# Altium schematic sheet Glucometer-E.C.- Full V1.2.SchDoc
size Letter; PageSetup: Record=PageOptions|CenterHorizontal=True|CenterVertical=True|PrintScale=0.95|XCorrection=1.00|YCorrection=1.00|PrintKind=2|BorderSize=5000000|LeftOffset=0|BottomOffset=0|Orientation=2|PaperLength=1000|PaperWidth=1000|Scale=100|PaperSource=7|PrintQuality=-4|MediaType=1|DitherType=10|PaperKind=Carta|PrintScaleMode=1
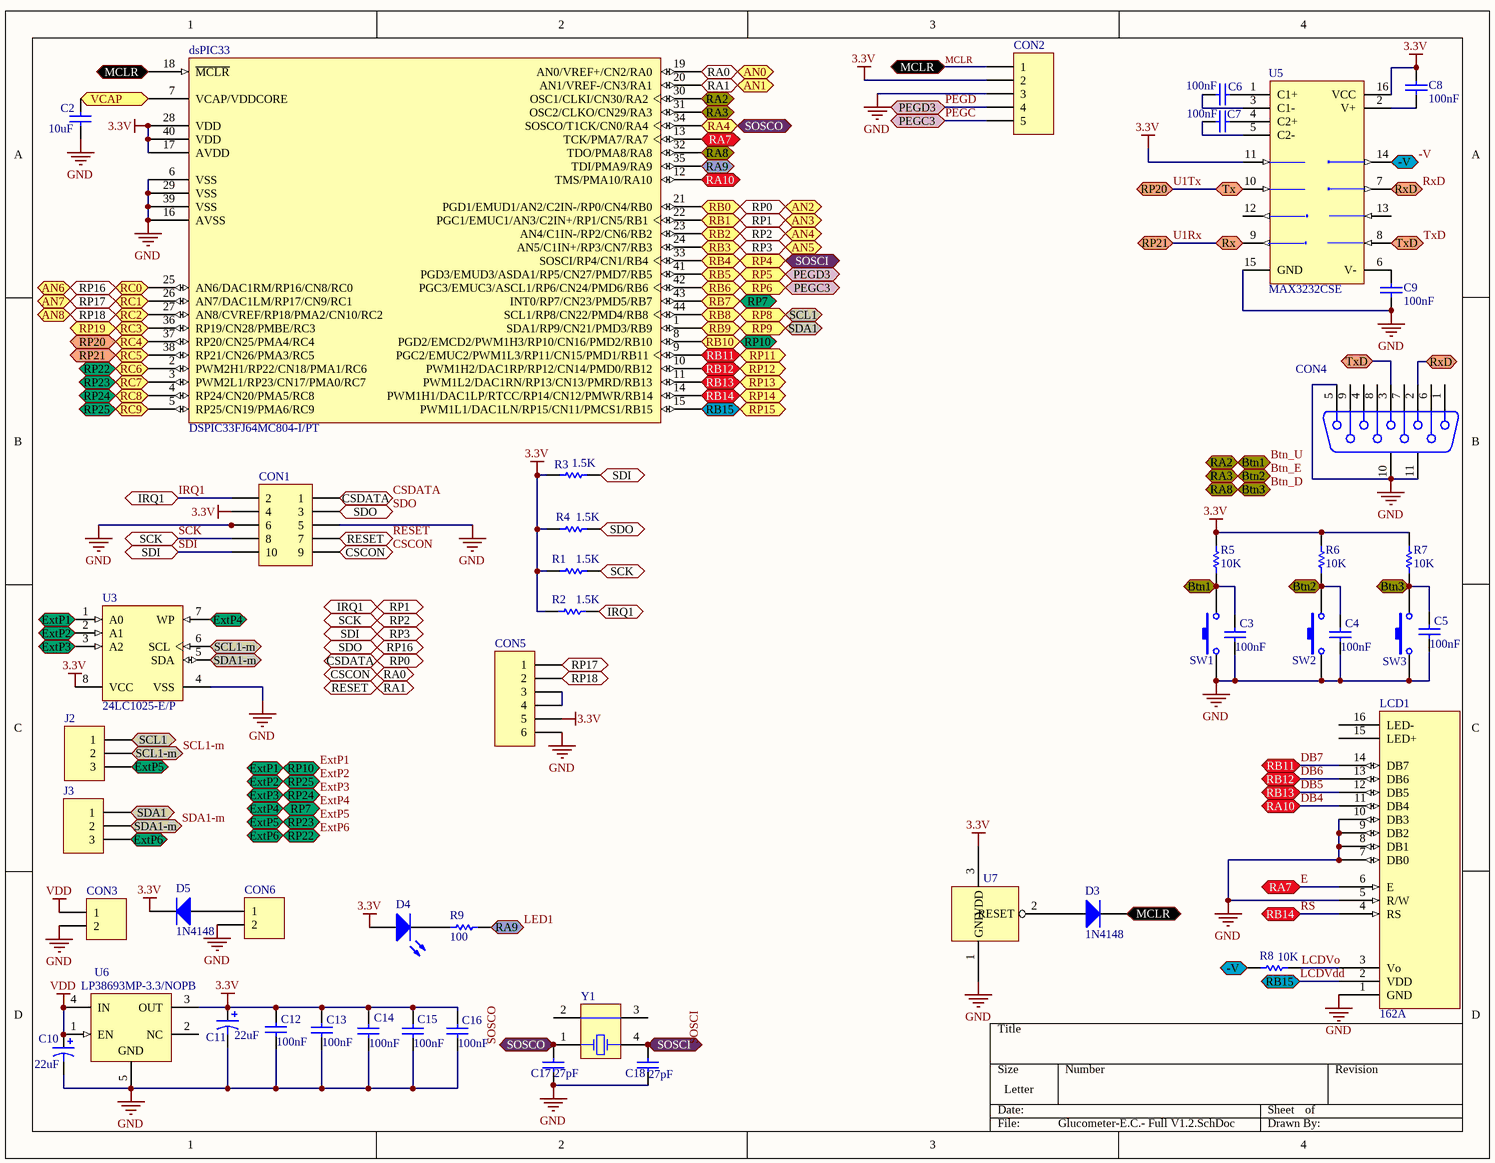
[diagram p0: Glucometer-E.C.- Full V1.2.SchDoc]

## Parts
C2  value 10uF  [CAPC2012N]  (hidden comment: Cap)
C3  value 100nF  [CAPC1608N]  (hidden comment: Cap)
C4  value 100nF  [CAPC1608N]  (hidden comment: Cap)
C5  value 100nF  [CAPC1608N]  (hidden comment: Cap)
C6  value 100nF  [RESC1608N]  (hidden comment: Cap)
C7  value 100nF  [RESC1608N]  (hidden comment: Cap)
C8  value 100nF  [RESC1608N]  (hidden comment: Cap)
C9  value 100nF  [RESC1608N]  (hidden comment: Cap)
C10  value 22uF  [C-4x4]  (hidden comment: Cap Pol2)
C11  value 22uF  [C-4x4]  (hidden comment: Cap Pol2)
C12  value 100nF  [CAPC1608N]  (hidden comment: Cap)
C13  value 100nF  [CAPC1608N]  (hidden comment: Cap)
C14  value 100nF  [CAPC1608N]  (hidden comment: Cap)
C15  value 100nF  [CAPC1608N]  (hidden comment: Cap)
C16  value 100nF  [CAPC1608N]  (hidden comment: Cap)
C17  value 27pF  [CAPC1608N]  (hidden comment: Cap)
C18  value 27pF  [CAPC1608N]  (hidden comment: Cap)
CON1  Header 5X2  [HDR2X5]  (value not drawn)
CON2  Header 5  [HDR1X5]  (value not drawn)
CON3  Header 2  [HDR1X2]  (value not drawn)
CON4  D Connector 9  [DSUB1.385-2H9]  (value not drawn)
CON5  Header 6  [HDR1X6]  (value not drawn)
CON6  Header 2  [HDR1X2]  (value not drawn)
D3  1N4148  [CD3216-1206]
D4  LED2  [3.2X1.6X1.1]  (value not drawn)
D5  1N4148  [DO-35]
dsPIC33  DSPIC33FJ64MC804-I/PT  [TQFP-PT44_N]
J2  Header 3  [HDR1X3]  (value not drawn)
J3  Header 3  [HDR1X3]  (value not drawn)
LCD1  162A  [HDR1X14]
R1  value 1.5K  [RESC2012N]  (hidden comment: Res1)
R2  value 1.5K  [RESC2012N]  (hidden comment: Res1)
R3  value 1.5K  [RESC2012N]  (hidden comment: Res1)
R4  value 1.5K  [RESC2012N]  (hidden comment: Res1)
R5  value 10K  [RESC2012N]  (hidden comment: Res1)
R6  value 10K  [RESC2012N]  (hidden comment: Res1)
R7  value 10K  [RESC2012N]  (hidden comment: Res1)
R8  value 10K  [RESC2012N]  (hidden comment: Res1)
R9  value 100  [RESC2012N]  (hidden comment: Res1)
SW1  SW-PB  [DPST-4]  (value not drawn)
SW2  SW-PB  [DPST-4]  (value not drawn)
SW3  SW-PB  [DPST-4]  (value not drawn)
U3  24LC1025-E/P  [PDIP300-P8]
U5  MAX3232CSE  [NSO16_N]
U6  LP38693MP-3.3/NOPB  [MP05A_N]
U7  Supply Voltage Supervisor  [SOT23]  (value not drawn)
Y1  ECS-240-20-7S  [ECX-3S]  (value not drawn)

## Ports
-V, AN0, AN1, AN2, AN3, AN4, AN5, AN6, AN7, AN8, Btn1, Btn2, Btn3, CSCON, CSDATA, ExtP1, ExtP2, ExtP3, ExtP4, ExtP5, ExtP6, IRQ1, MCLR, PEGC3, PEGD3, RA0, RA1, RA2, RA3, RA4, RA7, RA8, RA9, RA10, RB0, RB1, RB2, RB3, RB4, RB5, RB6, RB7, RB8, RB9, RB10, RB11, RB12, RB13, RB14, RB15, RC0, RC1, RC2, RC3, RC4, RC5, RC6, RC7, RC8, RC9, RESET, RP0, RP1, RP2, RP3, RP4, RP5, RP6, RP7, RP8, RP9, RP10, RP11, RP12, RP13, RP14, RP15, RP16, RP17, RP18, RP19, RP20, RP21, RP22, RP23, RP24, RP25, Rx, RxD, SCK, SCL1, SCL1-m, SDA1, SDA1-m, SDI, SDO, SOSCI, SOSCO, Tx, TxD, VCAP

## Nets
3.3V: C8.1 C11.1 C12.2 C13.2 C14.2 C15.2 C16.2 CON1.4 CON2.2 CON5.5 D4.1(A) D5.2(K) dsPIC33.17(AVDD) dsPIC33.28(VDD) dsPIC33.40(VDD) R1.1 R2.1 R3.1 R4.1 R5.2 R6.2 R7.2 U3.8(VCC) U5.11(T1IN) U5.16(VCC) U6.3(OUT) U7.3(VDD)
GND: C2.1 C3.1 C4.1 C5.1 C9.2 C10.2 C11.2 C12.1 C13.1 C14.1 C15.1 C16.1 C17.1 C18.1 CON1.5 CON1.6 CON2.3 CON3.2 CON4.5 CON4.10(MH1) CON4.11(MH2) CON5.6 CON6.2 dsPIC33.6(VSS) dsPIC33.16(AVSS) dsPIC33.29(VSS) dsPIC33.39(VSS) LCD1.1(GND) LCD1.5(R/W) LCD1.7(DB0) LCD1.8(DB1) LCD1.9(DB2) LCD1.10(DB3) SW1.1 SW2.1 SW3.1 U3.4(VSS) U5.15(GND) U6.5(GND) U7.1(GND)
VDD: C10.1 CON3.1 U6.1(EN) U6.4(IN)
-V: R8.2 U5.14(T1OUT) ; port -V
AN7: CON5.1 dsPIC33.26(AN7/DAC1LM/RP17/CN9/RC1) ; port AN7, port RC1, port RP17
AN8: CON5.2 dsPIC33.27(AN8/CVREF/RP18/PMA2/CN10/RC2) ; port AN8, port RC2, port RP18
Btn_D: C5.2 dsPIC33.32(TDO/PMA8/RA8) R7.1 SW3.2 ; port RA8, port Btn3
Btn_E: C4.2 dsPIC33.31(OSC2/CLKO/CN29/RA3) R6.1 SW2.2 ; port RA3, port Btn2
Btn_U: C3.2 dsPIC33.30(OSC1/CLKI/CN30/RA2) R5.1 SW1.2 ; port Btn1, port RA2
CSCON: CON1.9 dsPIC33.19(AN0/VREF+/CN2/RA0) ; port RA0, port AN0, port CSCON
CSDATA: CON1.1 dsPIC33.21(PGD1/EMUD1/AN2/C2IN-/RP0/CN4/RB0) ; port RB0, port RP0, port AN2, port CSDATA
DB4: dsPIC33.12(TMS/PMA10/RA10) LCD1.11(DB4) ; port RA10
DB5: dsPIC33.11(PWM1L2/DAC1RN/RP13/CN13/PMRD/RB13) LCD1.12(DB5) ; port RP13, port RB13
DB6: dsPIC33.10(PWM1H2/DAC1RP/RP12/CN14/PMD0/RB12) LCD1.13(DB6) ; port RP12, port RB12
DB7: dsPIC33.9(PGC2/EMUC2/PWM1L3/RP11/CN15/PMD1/RB11) LCD1.14(DB7) ; port RP11, port RB11
E: dsPIC33.13(TCK/PMA7/RA7) LCD1.6(E) ; port RA7
ExtP1: dsPIC33.8(PGD2/EMCD2/PWM1H3/RP10/CN16/PMD2/RB10) U3.1(A0) ; port RB10, port ExtP1, port RP10
ExtP2: dsPIC33.5(RP25/CN19/PMA6/RC9) U3.2(A1) ; port ExtP2, port RC9, port RP25
ExtP3: dsPIC33.4(RP24/CN20/PMA5/RC8) U3.3(A2) ; port ExtP3, port RC8, port RP24
ExtP4: dsPIC33.43(INT0/RP7/CN23/PMD5/RB7) U3.7(WP) ; port RB7, port ExtP4, port RP7
ExtP5: dsPIC33.3(PWM2L1/RP23/CN17/PMA0/RC7) J2.3 ; port ExtP5, port RC7, port RP23
ExtP6: dsPIC33.2(PWM2H1/RP22/CN18/PMA1/RC6) J3.3 ; port ExtP6, port RC6, port RP22
IRQ1: CON1.2 dsPIC33.22(PGC1/EMUC1/AN3/C2IN+/RP1/CN5/RB1) R2.2 ; port RB1, port RP1, port AN3, port IRQ1
LCDVdd: dsPIC33.15(PWM1L1/DAC1LN/RP15/CN11/PMCS1/RB15) LCD1.2(VDD) ; port RP15, port RB15
LCDVo: LCD1.3(Vo) R8.1
LED1: dsPIC33.35(TDI/PMA9/RA9) R9.1 ; port RA9
MCLR: CON2.1 D3.2(K) dsPIC33.18(~{MCLR}) ; port MCLR
PEGC: CON2.5 dsPIC33.42(PGC3/EMUC3/ASCL1/RP6/CN24/PMD6/RB6) ; port RB6, port RP6, port PEGC3
PEGD: CON2.4 dsPIC33.41(PGD3/EMUD3/ASDA1/RP5/CN27/PMD7/RB5) ; port RB5, port RP5, port PEGD3
RB8: dsPIC33.44(SCL1/RP8/CN22/PMD4/RB8) J2.1 ; port RP8, port SCL1, port RB8
RB9: dsPIC33.1(SDA1/RP9/CN21/PMD3/RB9) J3.1 ; port RP9, port SDA1, port RB9
RC3: dsPIC33.36(RP19/CN28/PMBE/RC3) ; port RC3, port RP19
RESET: CON1.7 dsPIC33.20(AN1/VREF-/CN3/RA1) ; port RA1, port AN1, port RESET
RS: dsPIC33.14(PWM1H1/DAC1LP/RTCC/RP14/CN12/PMWR/RB14) LCD1.4(RS) ; port RP14, port RB14
RxD: CON4.2 U5.7(T2OUT) ; port RxD
SCK: CON1.8 dsPIC33.23(AN4/C1IN-/RP2/CN6/RB2) R1.2 ; port RB2, port RP2, port AN4, port SCK
SCL1-m: J2.2 U3.6(SCL) ; port SCL1-m
SDA1-m: J3.2 U3.5(SDA) ; port SDA1-m
SDI: CON1.10 dsPIC33.24(AN5/C1IN+/RP3/CN7/RB3) R3.2 ; port RB3, port SDI, port RP3, port AN5
SDO: CON1.3 dsPIC33.25(AN6/DAC1RM/RP16/CN8/RC0) R4.2 ; port RP16, port AN6, port SDO, port RC0
SOSCI: C18.2 dsPIC33.33(SOSCI/RP4/CN1/RB4) Y1.4(OSC2) ; port RP4, port RB4, port SOSCI
SOSCO: C17.2 dsPIC33.34(SOSCO/T1CK/CN0/RA4) Y1.1(OSC1) ; port RA4, port SOSCO
TxD: CON4.3 U5.8(R2IN) ; port TxD
U1Rx: dsPIC33.38(RP21/CN26/PMA3/RC5) U5.9(R2OUT) ; port RP21, port Rx, port RC5
U1Tx: dsPIC33.37(RP20/CN25/PMA4/RC4) U5.10(T2IN) ; port RP20, port Tx, port RC4
VCAP: C2.2 dsPIC33.7(VCAP/VDDCORE) ; port VCAP
NetC6_1: C6.1 U5.1(C1+)
NetC6_2: C6.2 U5.3(C1-)
NetC7_1: C7.1 U5.4(C2+)
NetC7_2: C7.2 U5.5(C2-)
NetC8_2: C8.2 U5.2(V+)
NetC9_1: C9.1 U5.6(V-)
NetCON5_3: CON5.3 CON5.4
NetCON6_1: CON6.1 D5.1(A)
NetD3_1: D3.1(A) U7.2(RESET)
NetD4_2: D4.2(K) R9.2

Not connected (* = marked no-connect by the designer): CON4 1 4 6 7 8 9; LCD1 15(LED+) 16(LED-); U5 12(R1OUT) 13(R1IN); U6 2(NC); Y1 2(COM) 3(COM)

## Library data of the parts
C2-C9 C12-C18 = Cap: Capacitor; Published: 8-Jun-2000; LatestRevisionDate: 17-Jul-2002; LatestRevisionNote: Re-released for DXP Platform.; PackageReference: RAD-0.3; Publisher: Altium Limited; PackageDescription: Radial Cap, Thru-Hole; 2 Leads; 0.3 in Pin Spacing
C10 C11 = Cap Pol2: Polarized Capacitor (Axial); Published: 8-Jun-2000; LatestRevisionDate: 17-Jul-2002; LatestRevisionNote: Re-released for DXP Platform.; PackageReference: POLAR0.8; Publisher: Altium Limited; PackageDescription: Polarized Capacitor; 2 Leads
CON1 = Header 5X2: Header, 5-Pin, Dual row; LatestRevisionDate: 17-Jul-2002; LatestRevisionNote: Re-released for DXP Platform.; Publisher: Altium Limited
CON2 = Header 5: Header, 5-Pin; LatestRevisionDate: 17-Jul-2002; LatestRevisionNote: Re-released for DXP Platform.; Publisher: Altium Limited
CON3 CON6 = Header 2: Header, 2-Pin; LatestRevisionDate: 17-Jul-2002; LatestRevisionNote: Re-released for DXP Platform.; Publisher: Altium Limited
CON4 = D Connector 9: Receptacle Assembly, 9 Position, Right Angle; PackageDocument: O; Positions: 9; Published: 15-Jun-2001; LatestRevisionDate: 17-Jul-2002; LatestRevisionNote: Re-released for DXP Platform.; DatasheetDocument: 1-Sep-1999; PackageReference: 788750; Publisher: Altium Limited; Orientation: Right Angle; Gender: Receptacle
CON5 = Header 6: Header, 6-Pin; LatestRevisionDate: 17-Jul-2002; LatestRevisionNote: Re-released for DXP Platform.; Publisher: Altium Limited
D3 D5 = 1N4148: High Conductance Fast Diode; Published: 8-Jun-2000; LatestRevisionDate: 17-Jul-2002; LatestRevisionNote: Re-released for DXP Platform.; DatasheetDocument: 1997; PackageReference: DO-35; Publisher: Altium Limited; Code_JEDEC: DO-204-AH; ComponentLink1Description: Manufacturer Link; ComponentLink1URL: http://www.fairchildsemi.com/; ComponentLink2Description: Datasheet; ComponentLink2URL: http://www.fairchildsemi.com/ds/1N%2F1N4148.pdf
D4 = LED2: Typical RED, GREEN, YELLOW, AMBER GaAs LED; Published: 8-Jun-2000; LatestRevisionDate: 17-Jul-2002; LatestRevisionNote: Re-released for DXP Platform.; PackageVersion: Feb-2002; PackageReference: 3.2X1.6X1.1; Publisher: Altium Limited; PackageDescription: SM LED; 2 Flat Leads
dsPIC33 = DSPIC33FJ64MC804-I/PT: High-Performance 16-bit Digital Signal Controller, 64 KB Flash, 16 KB RAM, 44-Pin TQFP, Industrial Temperature; Published: 2-Dec-2009; DatasheetVersion: revD, Nov-2009; PackageVersion: revBB, Aug-2009; PackageReference: TQFP-PT44; Publisher: Altium Limited; PackageDescription: 44-Lead Plastic Thin Quad Flatpack (PT) - 10x10x1mm Body, 2.00mm [TQFP]; Supplier 1: Digi-Key; Supplier Part Number 1: DSPIC33FJ64MC804-I/PT-ND; Supplier 2: Farnell; Supplier Part Number 2: 1576844; Code_JEDEC: MS-026; ComponentLink1Description: Datasheet; ComponentLink1URL: http://ww1.microchip.com/downloads/en/DeviceDoc/70291D.pdf; ComponentLink2Description: Packaging Specification; ComponentLink2URL: http://www.microchip.com/stellent/groups/techpub_sg/documents/packagingspec/en012702.pdf; ComponentLink3Description: Microchip.com Home; ComponentLink3URL: http://www.microchip.com/
J2 J3 = Header 3: Header, 3-Pin; LatestRevisionDate: 17-Jul-2002; LatestRevisionNote: Re-released for DXP Platform.; Publisher: Altium Limited
LCD1 = 162A: 16 char * 2 line LCD character display with b/light
R1-R9 = Res1: Resistor; Published: 8-Jun-2000; LatestRevisionDate: 17-Jul-2002; LatestRevisionNote: Re-released for DXP Platform.; PackageReference: AXIAL-0.3; Publisher: Altium Limited; PackageDescription: Axial Device, Thru-Hole; 2 Leads; 0.3 in Pin Spacing
SW1-SW3 = SW-PB: Switch; Published: 24-Mar-1999; LatestRevisionDate: 17-Jul-2002; LatestRevisionNote: Re-released for DXP Platform.; PackageReference: SPST-2; Publisher: Altium Limited; PackageDescription: Switch; 2 Leads
U3 = 24LC1025-E/P: 1 Mbit, 400kHz, 2.5V, I2C Serial EEPROM, 8-Pin PDIP, Extended Temperature; Published: 29-Jan-2009; DatasheetVersion: revF, Oct-2008; PackageVersion: revBB, Aug-2009; PackageReference: PDIP300-P8; Publisher: Altium Limited; PackageDescription: 8-Lead Plastic Dual In-Line (P) - 300 mil Body [PDIP]; Supplier 1: Digi-Key; Supplier Part Number 1: 24LC1025-E/P-ND; Supplier 2: Farnell; Supplier Part Number 2: 1815993; Code_JEDEC: MS-001; ComponentLink1Description: Datasheet; ComponentLink1URL: http://ww1.microchip.com/downloads/en/DeviceDoc/21941F.pdf; ComponentLink2Description: Packaging Specification; ComponentLink2URL: http://www.microchip.com/stellent/groups/techpub_sg/documents/packagingspec/en012702.pdf; ComponentLink3Description: Microchip.com Home; ComponentLink3URL: http://www.microchip.com/
U5 = MAX3232CSE: 3.0V TO 5.5V, Low-Power, up to 1Mbps, True RS-232 Transceiver Using Four 0.1µF External Capacitor; Published: 16-Jan-2001; LatestRevisionDate: 13-Apr-2006; LatestRevisionNote: IPC-7351 Footprint Added.; DatasheetVersion: Mar-1999; PackageReference: NSO16; Publisher: Altium Limited; PackageDescription: 16-Pin Small Outline Integrated Circuit 1.27 mm Pitch; Code_JEDEC: MS-012-AC; Code_IPC: SOIC127P600-16; ComponentLink1Description: Manufacturer Link; ComponentLink1URL: http://www.maxim-ic.com/; ComponentLink2Description: Datasheet; ComponentLink2URL: http://pdfserv.maxim-ic.com/en/ds/MAX3222-MAX3241.pdf
U6 = LP38693MP-3.3/NOPB: 500mA Low Dropout CMOS Linear Regulators Stable with Ceramic Output Capacitors, 5-pin SOT-223, Pb-Free; Manufacturer: National Semiconductor; PackageTopMarking: XYTT*LJYB; PowerWise: Y; CompType: LDO IC; Published: 1-Mar-2010; DatasheetVersion: Sep-2005; PackageVersion: revA, Jan-2000; PackageReference: MP05A; Publisher: Altium Limited; PackageDescription: Moldec SOT-223, 6.50 x 3.56 x 1.6mm Body, 5 Lead, 1.5mm Pitch; Supplier 1: Digi-Key; Supplier Part Number 1: LP38693MP-3.3TR-ND; Supplier 2: Digi-Key; Supplier Part Number 2: LP38693MP-3.3CT-ND; Supplier 3: Digi-Key; Supplier Part Number 3: LP38693MP-3.3DKR-ND; Supplier 4: Farnell; Supplier Part Number 4: 1559648; PartNumber: LP38693MP-3.3/NOPB; RoHS: Y; PinCount: 5; Code_JEDEC: TO-261-AB; Code_IPC: SOT223-5; ComponentLink1Description: LP38693 Datasheet; ComponentLink1URL: http://www.national.com/ds/LP/LP38693.pdf; ComponentLink2Description: LP38693 Web Page; ComponentLink2URL: http://www.national.com/pf/LP/LP38693.html; ComponentLink3Description: MP05A Package Page; ComponentLink3URL: http://www.national.com/packaging/folders/mp05a.html
Y1 = ECS-240-20-7S: Crystal Oscillator; Published: 17-Jul-2002; DatasheetDocument: 18-Apr-2000; PackageReference: ECX-3S; Publisher: Altium Limited; ComponentLink1Description: Manufacturer Link; ComponentLink1URL: http://www.ecsxtal.com/; ComponentLink2Description: Datasheet; ComponentLink2URL: http://www.ecsxtal.com/pdf/ecx-3s.pdf